# Altium schematic sheet eps_power.SchDoc
size A4
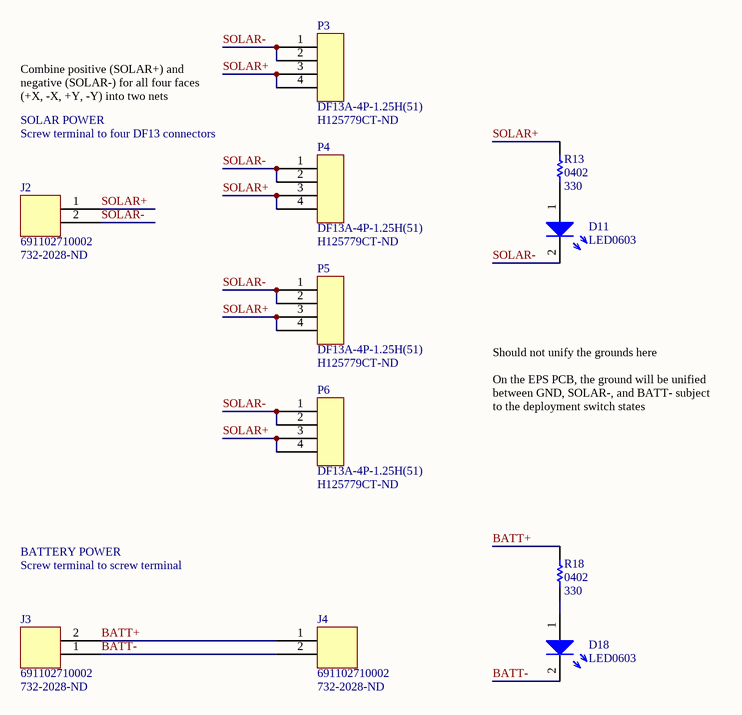
[diagram p0: eps_power.SchDoc]

## Parts
D11  LED0603  [LED0603]
D18  LED0603  [LED0603]
J2  691102710002  Supplier Part Number 1: 732-2028-ND  [CON2_SCREW_5.00MM_691102710002]
J3  691102710002  Supplier Part Number 1: 732-2028-ND  [CON2_SCREW_5.00MM_691102710002]
J4  691102710002  Supplier Part Number 1: 732-2028-ND  [CON2_SCREW_5.00MM_691102710002]
P3  DF13A-4P-1.25H(51)  Supplier Part Number 1: H125779CT-ND  [DF13A-4P-1.25H(51)]
P4  DF13A-4P-1.25H(51)  Supplier Part Number 1: H125779CT-ND  [DF13A-4P-1.25H(51)]
P5  DF13A-4P-1.25H(51)  Supplier Part Number 1: H125779CT-ND  [DF13A-4P-1.25H(51)]
P6  DF13A-4P-1.25H(51)  Supplier Part Number 1: H125779CT-ND  [DF13A-4P-1.25H(51)]
R13  0402  value 330  [RES0402R]
R18  0402  value 330  [RES0402R]

## Nets
BATT+: J3.2 J4.1 R18.2
BATT-: D18.2 J3.1 J4.2
SOLAR+: J2.1 P3.3 P3.4 P4.3 P4.4 P5.3 P5.4 P6.3 P6.4 R13.1
SOLAR-: D11.2 J2.2 P3.1 P3.2 P4.1 P4.2 P5.1 P5.2 P6.1 P6.2
NetD11_1: D11.1 R13.2
NetD18_1: D18.1 R18.1

## Notes on the sheet
- Combine positive (SOLAR+) and negative (SOLAR-) for all four faces (+X, -X, +Y, -Y) into two nets
- SOLAR POWER
- Screw terminal to four DF13 connectors
- Should not unify the grounds here
- On the EPS PCB, the ground will be unified between GND, SOLAR-, and BATT- subject to the deployment switch states
- BATTERY POWER
- Screw terminal to screw terminal

## Library data of the parts
D11 D18 = LED0603: Generic 0603 LED. Use ChipLED from Osram for generic ones.
J2-J4 = 691102710002: 2-POS screw terminal, 5mm pitch; Supplier 1: Digi-Key
P3-P6 = DF13A-4P-1.25H(51): 4 pos DF13 right angle surface mount connector; Supplier 1: Digi-Key
R13 R18 = RES0402: 0402 resistor